# EAGLE design pruebaTension (EAGLE 8.6.3)
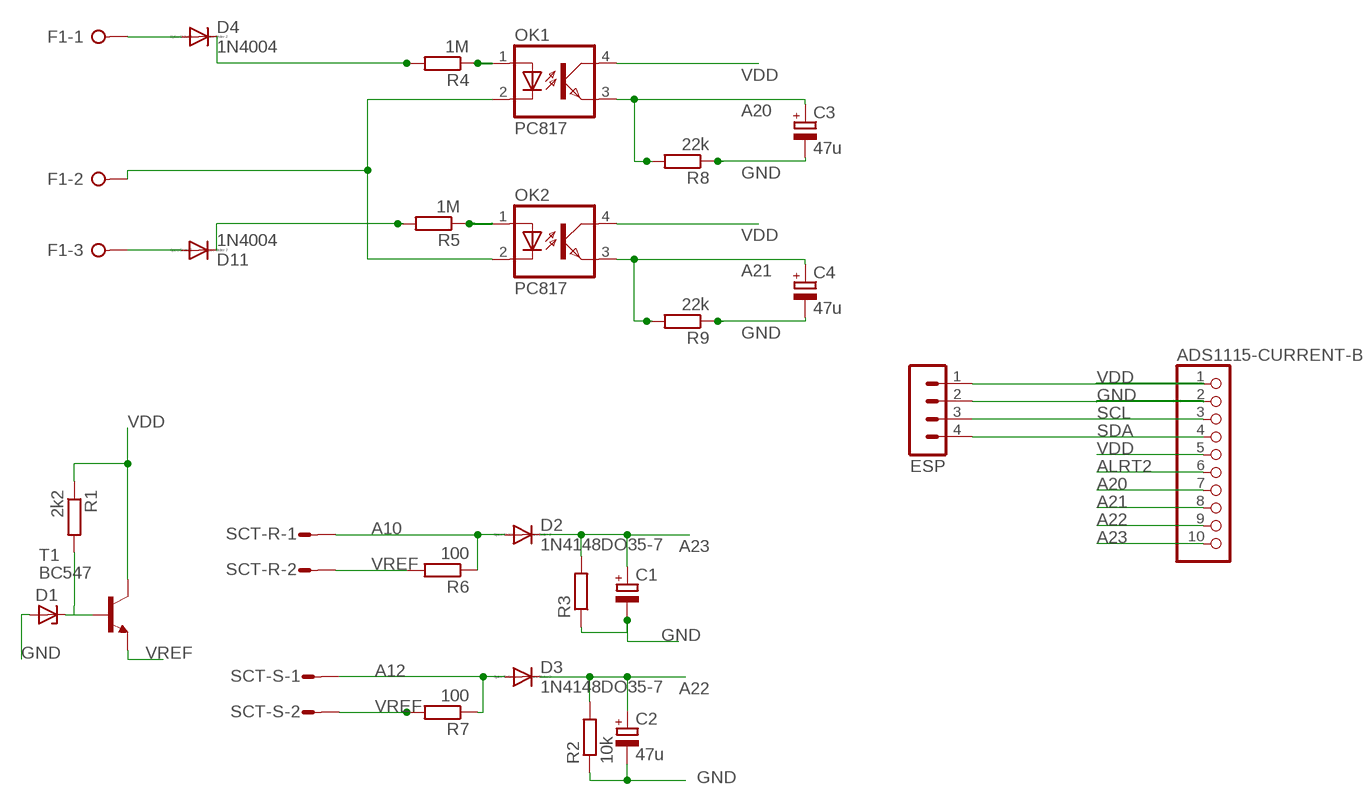
[diagram p0: schematic, sheet 1]

## Parts
ADS1115-CURRENT-B  PINHD-1X10  [1X10]
C1  CPOL-EUE2.5-7  [E2,5-7]
C2  47u  CPOL-EUE2.5-7  [E2,5-7]
C3  47u  CPOL-EUE2.5-7  [E2,5-7]
C4  47u  CPOL-EUE2.5-7  [E2,5-7]
D1  ZENER-DIODEZD-2.5  [ZDIO-2.5]
D2  1N4148DO35-7  [DO35-7]
D3  1N4148DO35-7  [DO35-7]
D4  1N4004  [DO41-10]
D11  1N4004  [DO41-10]
ESP  MA04-1  [MA04-1]
F1  W237-3E  [W237-3E]
OK1  PC817  [DIL04]
OK2  PC817  [DIL04]
R1  2k2  R-EU_0204/2V  [0204V]
R2  10k  R-EU_0204/2V  [0204V]
R3  R-EU_0204/2V  [0204V]
R4  1M  R-EU_0204/2V  [0204V]
R5  1M  R-EU_0204/2V  [0204V]
R6  100  R-EU_0204/2V  [0204V]
R7  100  R-EU_0204/2V  [0204V]
R8  22k  R-EU_0204/2V  [0204V]
R9  22k  R-EU_0204/2V  [0204V]
SCT-R  S02P  [S02P]
SCT-S  S02P  [S02P]
T1  BC547  [TO92]

## Nets
A10: D2.A R6.1 SCT-R.1
A12: D3.A R7.1 SCT-S.1
A20: ADS1115-CURRENT-B.7 C3.+ OK1.3(EMIT) R8.2
A21: ADS1115-CURRENT-B.8 C4.+ OK2.3(EMIT) R9.2
A22: ADS1115-CURRENT-B.9 C2.+ D3.C R2.2
A23: ADS1115-CURRENT-B.10 C1.+ D2.C R3.2
ALRT2: ADS1115-CURRENT-B.6
GND [source]: ADS1115-CURRENT-B.2 C1.- C2.- C3.- C4.- D1.A ESP.2 R2.1 R3.1 R8.1 R9.1
N$1: D11.A F1.3
N$2: D1.C R1.2 T1.2(B)
N$3: F1.2 OK1.2(C) OK2.2(C)
N$4: D4.A F1.1
N$9: OK2.1(A) R5.1
N$10: OK1.1(A) R4.1
N$11: D11.C R5.2
N$14: D4.C R4.2
SCL: ADS1115-CURRENT-B.3 ESP.3
SDA: ADS1115-CURRENT-B.4 ESP.4
VDD [source]: ADS1115-CURRENT-B.1 ADS1115-CURRENT-B.5 ESP.1 OK1.4(COL) OK2.4(COL) R1.1 T1.3(C)
VREF: R6.2 R7.2 SCT-R.2 SCT-S.2 T1.1(E)

## Library data of the parts
ADS1115-CURRENT-B = pinhead:PINHD-1X10: PIN HEADER
C1-C4 = rcl:CPOL-EU: POLARIZED CAPACITOR, European symbol; SPICEPREFIX: C
D1 = diode:ZENER-DIODE: Z-Diode
D2 D3 = diode:1N4148: DIODE high speed (Philips)
D4 D11 = diode:1N4004: DIODE general purpose rectifier, 1 A
ESP = con-lstb:MA04-1: PIN HEADER; OC_FARNELL: unknown; OC_NEWARK: unknown
F1 = con-wago-508:W237-3E: WAGO SREW CLAMP; OC_FARNELL: unknown; OC_NEWARK: unknown
OK1 OK2 = optocoupler:PC817: SHARP OPTO COUPLER; MPN: PC817X4J000F; OC_FARNELL: 9707727; OC_NEWARK: 97K7059
R1-R9 = resistor:R-EU_: RESISTOR, European symbol
SCT-R SCT-S = con-amp-mt:S02P: AMP MT CONNECTOR; OC_FARNELL: unknown; OC_NEWARK: unknown
T1 = transistor:BC547: NPN TRANSISTOR

## Net classes
0 default: width 0.5 mm, drill 0.7 mm, clearance 0.5 mm
1 source: width 0.8 mm, drill 0.7 mm, clearance 0.5 mm

## Board
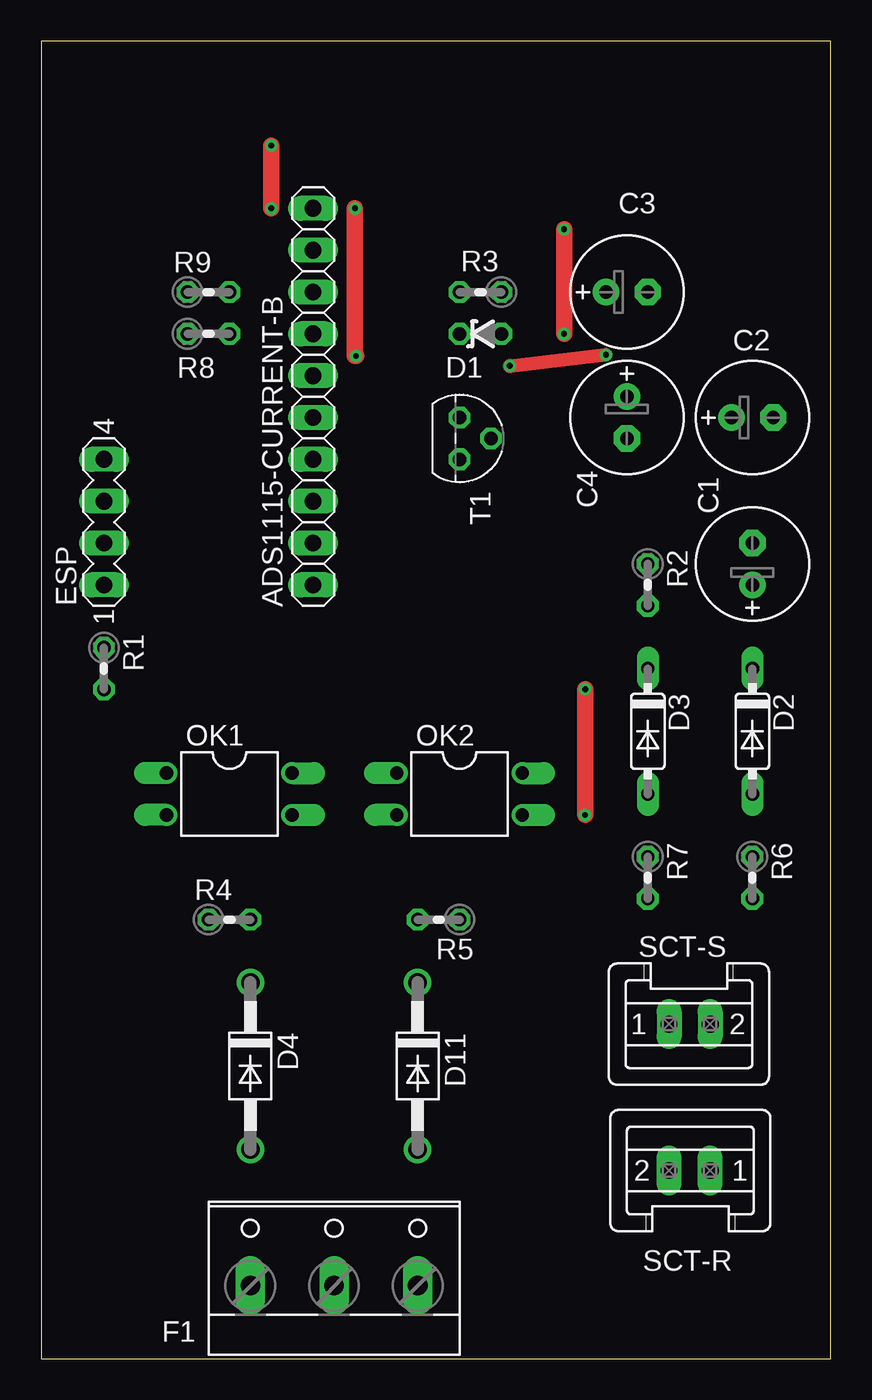
[diagram p1: board, top side]
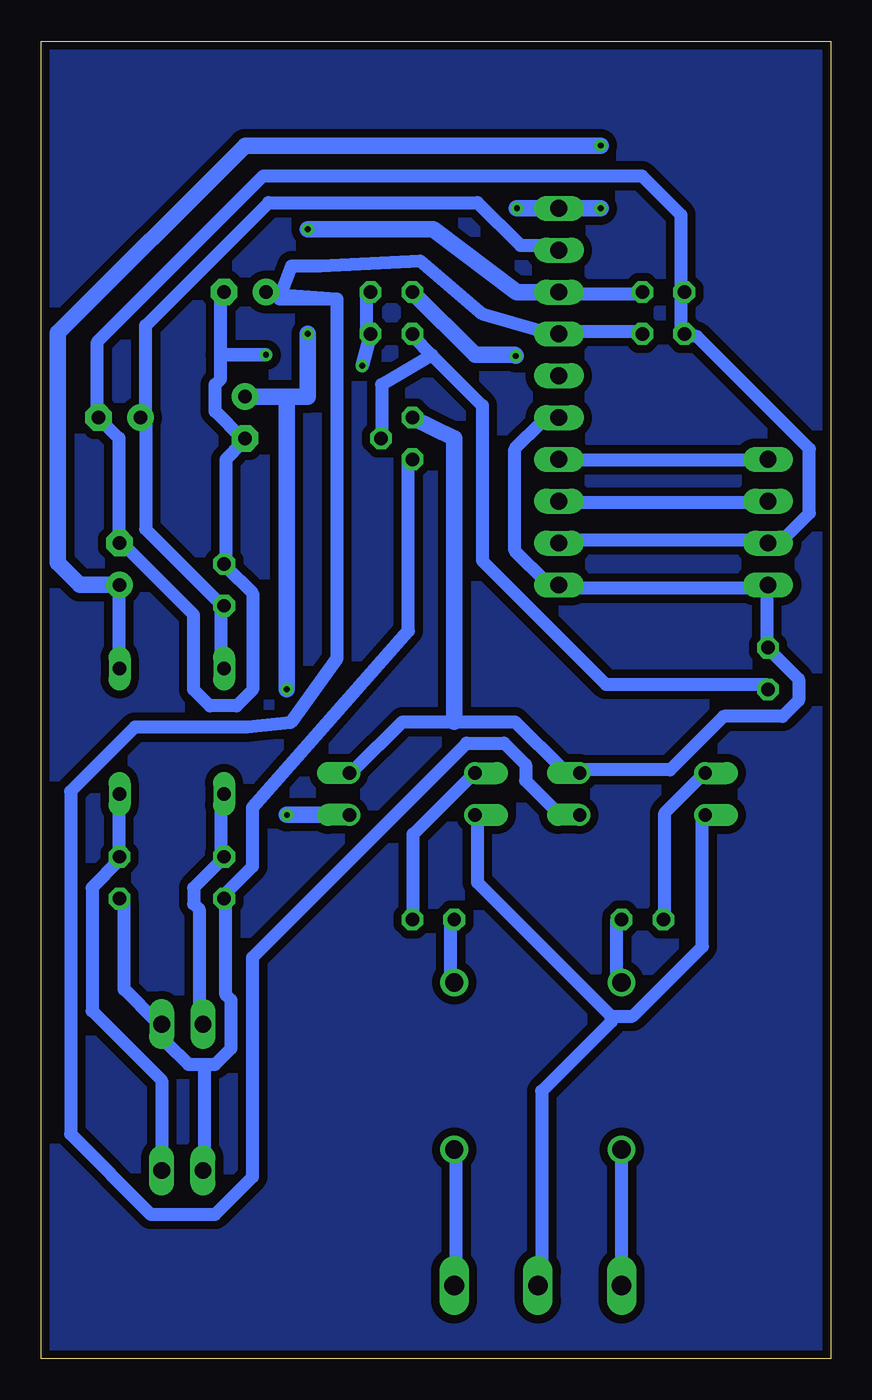
[diagram p2: board, bottom side, seen from below]

Size 47.93 x 80 mm. Coordinates in mm from the lower left corner, seen from the top.
Outline: 0,0 47.93,0 47.93,80 0,80 0,0
Copper layers (1*16): Top 0.035mm / dielectric 1.5mm / Bottom 0.035mm
Design rules "default *": minimum track width 0.8mm, minimum drill 0.8mm, track to track 0.5mm, track to pad 0.5mm, pad to pad 0.5mm, via to via 0.5mm, smd to smd 0.5mm, copper to edge 0.5mm, drill to drill 0.5mm, minimum pad ring 10mil, minimum via ring 8mil, stop-mask expansion 0.5mm, vias tented up to drill 0mil, thermal gap 10mil

### Footprints (pad centres in the part's own frame; a part is rotated, then mirrored left to right if it is on the bottom)
1X10 = drill 1.016 long: 1 -11.43,0; 2 -8.89,0; 3 -6.35,0; 4 -3.81,0; 5 -1.27,0; 6 1.27,0; 7 3.81,0; 8 6.35,0; 9 8.89,0; 10 11.43,0
E2,5-7 = drill 0.813 pad 1.6: + -1.27,0 | drill 0.813 pad 1.6 octagon: - 1.27,0
ZDIO-2.5 = drill 0.813 octagon: A 1.27,0; C -1.27,0
DO35-7 = drill 0.813 long: A 3.81,0; C -3.81,0
DO41-10 = drill 1.118: A 5.08,0; C -5.08,0
MA04-1 = drill 1.016 long: 1 -3.81,0; 2 -1.27,0; 3 1.27,0; 4 3.81,0
W237-3E = drill 1.194 long: 1 -5.08,-0.635; 2 0,-0.635; 3 5.08,-0.635
DIL04 = drill 0.813 offset: 1 -1.27,-3.81; 2 1.27,-3.81; 3 1.27,3.81; 4 -1.27,3.81
0204V = drill 0.813 octagon: 1 -1.27,0; 2 1.27,0
S02P = drill 1.016 long: 1 1.25,0; 2 -1.25,0
TO92 = drill 0.813 octagon: 1 1.27,0; 2 0,1.905; 3 -1.27,0

### Placement (x,y rotation side)
ADS1115-CURRENT-B  16.51,58.42 90 top
C1  43.18,48.26 90 top
C2  43.18,57.15 0 top
C3  35.56,64.77 0 top
C4  35.56,57.15 270 top
D1  26.67,62.23 0 top
D2  43.18,38.1 270 top
D3  36.83,38.1 270 top
D4  12.7,17.78 270 top
D11  22.86,17.78 270 top
ESP  3.81,50.8 90 top
F1  17.78,5.08 0 top
OK1  11.43,34.29 270 top
OK2  25.4,34.29 270 top
R1  3.81,41.91 270 top
R2  36.83,46.99 270 top
R3  26.67,64.77 180 top
R4  11.43,26.67 0 top
R5  24.13,26.67 180 top
R6  43.18,29.21 270 top
R7  36.83,29.21 270 top
R8  10.16,62.23 0 top
R9  10.16,64.77 0 top
SCT-R  39.37,11.43 0 top
SCT-S  39.37,20.32 180 top
T1  25.4,55.88 270 top

### Tracks (layer width: path | path; a pad name or v marks a point on that pad's centre or on a via)
A10
  Bottom 0.8: D2.A 43.23,34.12 43.23,30.55 R6.1 43.23,30.23 44.85,28.6 44.85,21.12 40.62,16.9 40.62,11.7 SCT-R.1
A12
  Bottom 0.8: D3.A 37.05,34.12 37.05,30.55 R7.1 37.05,30.23 38.67,28.6 38.67,27.62 38.35,27.3 38.35,20.48 SCT-S.1
A20
  Bottom 0.8: R8.2 11.7,62.4 16.25,62.4 ADS1115-CURRENT-B.7 16.57,62.4 17.55,62.4 21.12,63.44 24.93,66.66 30.99,66.36 32.73,66.36 33.48,64.35 29.99,64.35 | 29.99,64.35 29.99,42.52 32.8,38.62 35.42,38.35 42.25,38.35 46.15,34.45 46.15,13.65 41.27,8.78 37.38,8.78 35.1,11.05 35.1,24.38 22.1,37.38 19.82,37.38 18.52,36.08 18.52,35.1 16.57,33.15 15.28,33.15 OK1.3 | 29.99,64.35 34.12,64.67 C3.+
A21  (via drill 0.35)
  Top 1.016: v33.02,33.02 v33.03,33.03 v33.03,40.66 | v31.75,68.58 v31.75,62.23
  Bottom 0.8: R9.2 11.7,64.67 16.25,64.67 ADS1115-CURRENT-B.8
  Bottom 1.016: OK2.3 v33.02,33.02 | v33.03,40.66 33.03,58.41 | 33.03,58.41 33.02,58.42 C4.+ | v31.75,68.58 24.13,68.58 19.05,64.77 ADS1115-CURRENT-B.8 | v31.75,62.23 31.75,58.42 33.03,58.41
A22
  Bottom 0.8: D3.C 37.05,41.92 37.05,45.5 R2.2 37.05,45.83 41.6,50.38 41.6,56.88 C2.+ 41.6,57.2 41.6,62.73 34.12,70.2 21.45,70.2 18.85,67.6 16.57,67.6 ADS1115-CURRENT-B.9
A23  (via drill 0.35)
  Top 1.016: v19.05,69.85 19.05,60.89 v19.12,60.89 | v13.97,69.85 v13.97,73.66
  Bottom 0.8: D2.C 43.23,41.92 43.23,46.8 C1.+
  Bottom 1.016: v19.05,69.85 ADS1115-CURRENT-B.10 v13.97,69.85 | v19.12,60.89 19.19,60.96 21.59,60.96 R3.2 | C1.+ 45.58,46.99 46.92,48.33 46.92,62.3 35.56,73.66 v13.97,73.66
GND  (via drill 0.35)
  Top 0.813: v34.29,60.96 28.46,60.27 v28.45,60.29
  Bottom 0.8: ADS1115-CURRENT-B.2 16.25,49.73 3.9,49.73 ESP.2 3.58,49.73 2.92,49.73 1.3,51.35 1.3,55.25 8.12,62.08 8.78,62.08 R8.1 9.1,62.4 9.1,64.67 R9.1 9.1,65 9.1,69.46 11.46,71.83 34.45,71.83 44.52,61.75 44.52,57.52 C2.- 44.2,56.88 43.23,55.9 43.23,49.73 C1.- 42.9,49.4 38.67,45.17 38.67,40.62 37.7,39.65 36.08,39.65 35.1,40.62 35.1,46.48 36.73,48.1 R2.1 36.73,48.42 36.73,54.6 35.75,55.58 C4.- 35.75,55.9 37.38,57.52 37.38,59.15 37.05,59.48 37.05,60.96 37.05,64.67 C3.- | D1.A 28.21,62.46 28.21,64.73 R3.1
  Bottom 0.813: 37.05,60.96 v34.29,60.96 | v28.45,60.29 D1.A
N$1
  Bottom 0.8: D11.A 22.75,12.68 22.75,4.55 F1.3
N$2
  Bottom 0.8: 24.21,60.94 25.35,62.08 D1.C | 24.21,60.94 21.16,57.88 21.16,48.45 13.65,40.95 3.9,40.95 R1.2 | 24.21,60.94 27.27,59.15 27.27,55.93 T1.2
N$3
  Bottom 0.8: 13.32,20.8 12.03,20.8 7.8,25.02 7.8,32.83 OK1.2 | 13.32,20.8 21.45,28.93 21.45,32.83 OK2.2 | F1.2 17.55,4.55 17.55,16.25 13.32,20.48 13.32,20.8
N$4
  Bottom 0.8: D4.A 12.68,12.68 12.68,4.55 F1.1
N$5
  pour Bottom: 0.75,79.15 47.26,79.15 47.26,0.66 0.69,0.66 0.69,79.08
N$9
  Bottom 0.8: OK2.1 21.77,35.42 25.35,31.85 25.35,26.98 R5.1
N$10
  Bottom 0.8: OK1.1 7.8,35.42 10.07,33.15 10.07,26.98 R4.1
N$11
  Bottom 0.8: R5.2 23.07,26.65 23.07,23.07 D11.C
N$14
  Bottom 0.8: R4.2 13,26.65 13,23.07 D4.C
SCL
  Bottom 0.8: ESP.3 3.9,52 16.25,52 ADS1115-CURRENT-B.3
SDA
  Bottom 0.8: ESP.4 3.9,54.6 16.25,54.6 ADS1115-CURRENT-B.4
VDD
  Bottom 0.8: OK2.4 28.93,35.75 26,38.67 22.86,38.67 19.18,38.67 16.25,35.75 15.28,35.75 OK1.4 14.95,35.75 9.75,35.75 6.5,39 2.92,39 1.95,39.98 1.95,41.27 3.58,42.9 R1.1 3.9,43.23 3.9,46.8 ESP.1 4.22,46.8 16.25,46.8 ADS1115-CURRENT-B.1 16.9,47.12 17.23,47.12 19.18,49.08 19.18,55.25 17.55,56.88 16.57,56.88 ADS1115-CURRENT-B.5
  Bottom 1.016: T1.3 22.86,55.88 22.86,38.67
VREF
  Bottom 0.8: 38.02,17.88 39,17.88 40.3,19.18 40.3,20.15 SCT-S.2 40.95,20.48 42.9,22.43 42.9,27.62 R6.2 | 38.02,17.88 37.38,17.88 36.4,18.85 36.4,21.77 36.73,22.1 36.73,27.62 R7.2 36.73,28.27 35.1,29.9 35.1,33.48 25.64,44.2 25.64,54.3 T1.1 | 38.02,17.88 38.02,11.7 SCT-R.2